# Altium schematic sheet RF_Transceiver_LM6002D.SchDoc
size A4; DocumentNumber: 24; SheetNumber: 24; SheetTotal: 47
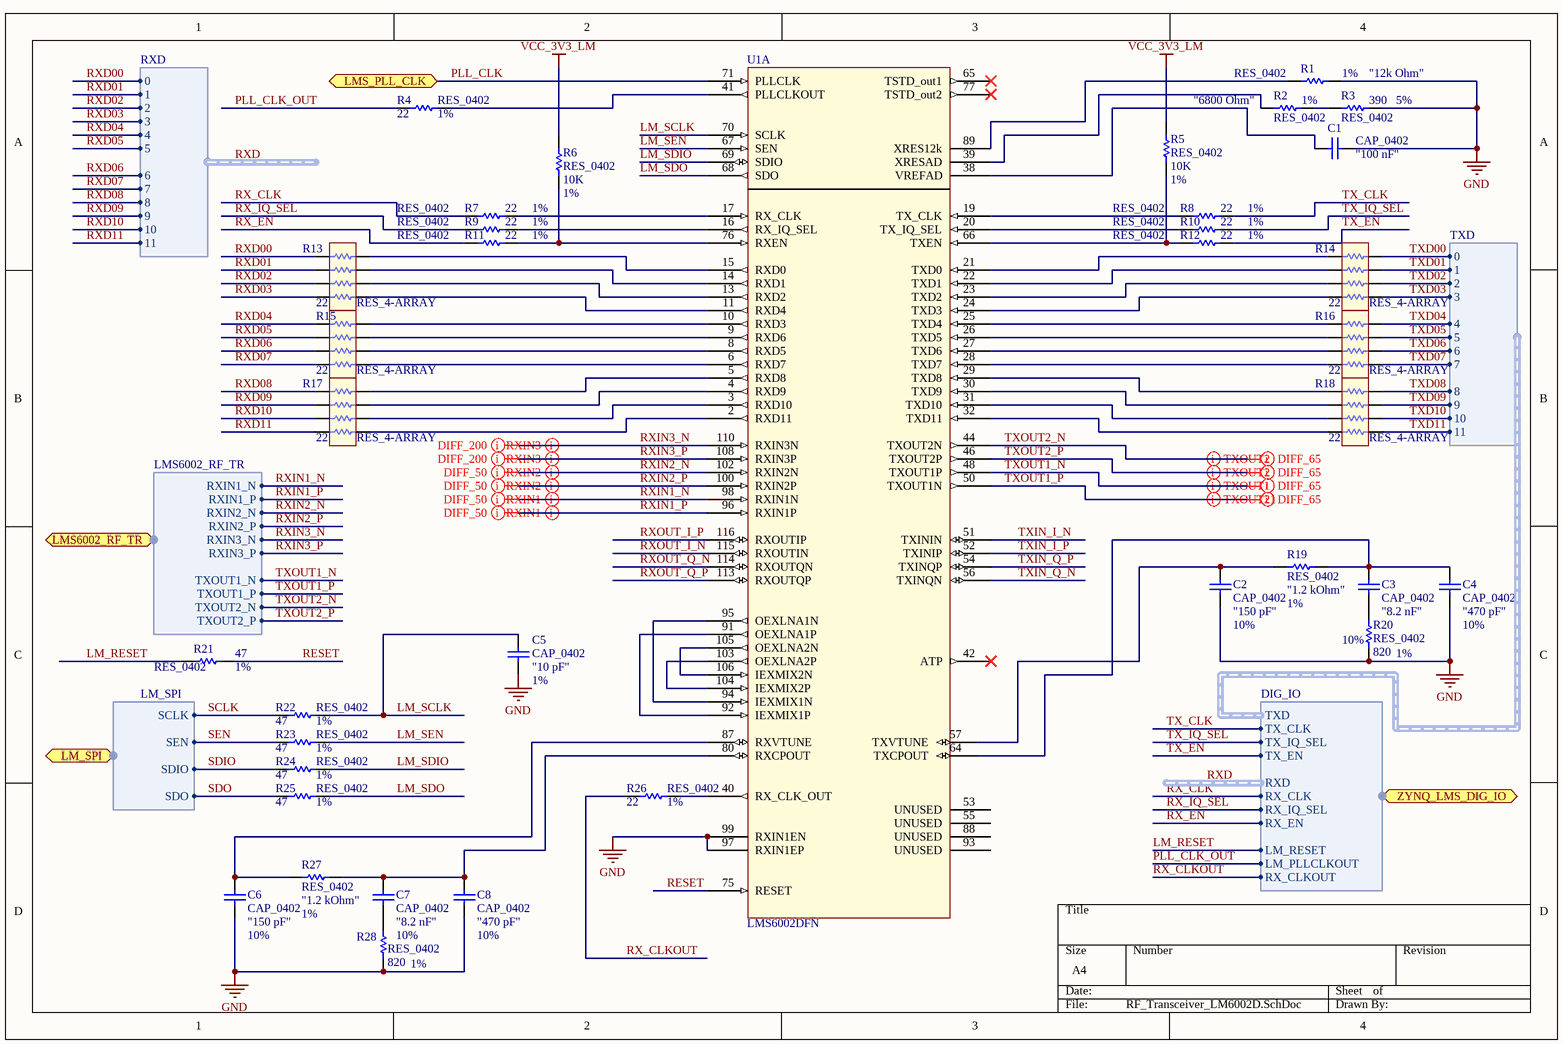
[diagram p0: RF_Transceiver_LM6002D.SchDoc]

## Parts
C1  CAP_0402  value "100 nF"  [CAPC0402(1005)60_N]
C2  CAP_0402  value "150 pF"  Tolerance: 10%  [CAPC0402(1005)60_N]
C3  CAP_0402  value "8.2 nF"  Tolerance: 10%  [CAPC0402(1005)60_N]
C4  CAP_0402  value "470 pF"  Tolerance: 10%  [CAPC0402(1005)60_N]
C5  CAP_0402  value "10 pF"  Tolerance: 1%  [CAPC0402(1005)60_N]
C6  CAP_0402  value "150 pF"  Tolerance: 10%  [CAPC0402(1005)60_N]
C7  CAP_0402  value "8.2 nF"  Tolerance: 10%  [CAPC0402(1005)60_N]
C8  CAP_0402  value "470 pF"  Tolerance: 10%  [CAPC0402(1005)60_N]
R1  RES_0402  value "12k Ohm"  Tolerance: 1%  [RESC0402(1005)_N]
R2  RES_0402  value "6800 Ohm"  Tolerance: 1%  [RESC0402(1005)_N]
R3  RES_0402  value 390  Tolerance: 5%  [RESC0402(1005)_N]
R4  RES_0402  value 22  Tolerance: 1%  [RESC0402(1005)_N]
R5  RES_0402  value 10K  Tolerance: 1%  [RESC0402(1005)_N]
R6  RES_0402  value 10K  Tolerance: 1%  [RESC0402(1005)_N]
R7  RES_0402  value 22  Tolerance: 1%  [RESC0402(1005)_N]
R8  RES_0402  value 22  Tolerance: 1%  [RESC0402(1005)_N]
R9  RES_0402  value 22  Tolerance: 1%  [RESC0402(1005)_N]
R10  RES_0402  value 22  Tolerance: 1%  [RESC0402(1005)_N]
R11  RES_0402  value 22  Tolerance: 1%  [RESC0402(1005)_N]
R12  RES_0402  value 22  Tolerance: 1%  [RESC0402(1005)_N]
R13  RES_4-ARRAY  value 22  [RES_4-ARRAY_YC124-JR-0722RL]
R14  RES_4-ARRAY  value 22  [RES_4-ARRAY_YC124-JR-0722RL]
R15  RES_4-ARRAY  value 22  [RES_4-ARRAY_YC124-JR-0722RL]
R16  RES_4-ARRAY  value 22  [RES_4-ARRAY_YC124-JR-0722RL]
R17  RES_4-ARRAY  value 22  [RES_4-ARRAY_YC124-JR-0722RL]
R18  RES_4-ARRAY  value 22  [RES_4-ARRAY_YC124-JR-0722RL]
R19  RES_0402  value "1.2 kOhm"  Tolerance: 1%  [RESC0402(1005)_N]
R20  RES_0402  value 820  Tolerance: 1%  [RESC0402(1005)_N]
R21  RES_0402  value 47  Tolerance: 1%  [RESC0402(1005)_N]
R22  RES_0402  value 47  Tolerance: 1%  [RESC0402(1005)_N]
R23  RES_0402  value 47  Tolerance: 1%  [RESC0402(1005)_N]
R24  RES_0402  value 47  Tolerance: 1%  [RESC0402(1005)_N]
R25  RES_0402  value 47  Tolerance: 1%  [RESC0402(1005)_N]
R26  RES_0402  value 22  Tolerance: 1%  [RESC0402(1005)_N]
R27  RES_0402  value "1.2 kOhm"  Tolerance: 1%  [RESC0402(1005)_N]
R28  RES_0402  value 820  Tolerance: 1%  [RESC0402(1005)_N]
U1  LMS6002DFN  [RF_Transceiver_LimeMicro_LMS6002D_DQFN-116]  (part A of 2)

## Ports
LM_SPI (harness LM_SPI), LMS6002_RF_TR (harness LMS6002_RF_TR), LMS_PLL_CLK (bidir), ZYNQ_LMS_DIG_IO (harness DIG_IO)

## Harnesses
LMS6002_RF_TR: RXIN1_N, RXIN1_P, RXIN2_N, RXIN2_P, RXIN3_N, RXIN3_P, TXOUT1_N, TXOUT1_P, TXOUT2_N, TXOUT2_P
LM_SPI: SCLK, SEN, SDIO, SDO
TXD: 0, 1, 2, 3, 4, 5, 6, 7, 8, 9, 10, 11
DIG_IO: TXD, TX_CLK, TX_IQ_SEL, TX_EN, RXD, RX_CLK, RX_IQ_SEL, RX_EN, LM_RESET, LM_PLLCLKOUT, RX_CLKOUT
RXD: 0, 1, 2, 3, 4, 5, 6, 7, 8, 9, 10, 11

## Nets
GND: C1.2 C2.1 C4.1 C5.1 C6.1 C8.1 R1.2 R3.2 R20.1 R28.1 U1.97(RXIN1EP) U1.99(RXIN1EN)
VCC_3V3_LM: R5.2 R6.2
LM_RESET: R21.1 ; port ZYNQ_LMS_DIG_IO.LM_RESET
LM_SCLK: C5.2 R22.2 U1.70(SCLK)
LM_SDIO: R24.2 U1.69(SDIO)
LM_SDO: R25.2 U1.68(SDO)
LM_SEN: R23.2 U1.67(SEN)
PLL_CLK: U1.71(PLLCLK) ; port LMS_PLL_CLK
PLL_CLK_OUT: R4.1 ; port ZYNQ_LMS_DIG_IO.LM_PLLCLKOUT
RESET: R21.2 U1.75(RESET)
RX_CLK: R7.1 ; port ZYNQ_LMS_DIG_IO.RX_CLK
RX_CLKOUT: R26.1 ; port ZYNQ_LMS_DIG_IO.RX_CLKOUT
RX_EN: R11.1 ; port ZYNQ_LMS_DIG_IO.RX_EN
RX_IQ_SEL: R9.1 ; port ZYNQ_LMS_DIG_IO.RX_IQ_SEL
RXD00: R13.8 ; harness RXD.0  [project net RXD.0]
RXD01: R13.7 ; harness RXD.1  [project net RXD.1]
RXD02: R13.6 ; harness RXD.2  [project net RXD.2]
RXD03: R13.5 ; harness RXD.3  [project net RXD.3]
RXD04: R15.8 ; harness RXD.4  [project net RXD.4]
RXD05: R15.7 ; harness RXD.5  [project net RXD.5]
RXD06: R15.6 ; harness RXD.6  [project net RXD.6]
RXD07: R15.5 ; harness RXD.7  [project net RXD.7]
RXD08: R17.8 ; harness RXD.8  [project net RXD.8]
RXD09: R17.7 ; harness RXD.9  [project net RXD.9]
RXD10: R17.6 ; harness RXD.10  [project net RXD.10]
RXD11: R17.5 ; harness RXD.11  [project net RXD.11]
RXIN1_N: U1.98(RXIN1N) ; port LMS6002_RF_TR.RXIN1_N
RXIN1_P: U1.96(RXIN1P) ; port LMS6002_RF_TR.RXIN1_P
RXIN2_N: U1.102(RXIN2N) ; port LMS6002_RF_TR.RXIN2_N
RXIN2_P: U1.100(RXIN2P) ; port LMS6002_RF_TR.RXIN2_P
RXIN3_N: U1.110(RXIN3N) ; port LMS6002_RF_TR.RXIN3_N
RXIN3_P: U1.108(RXIN3P) ; port LMS6002_RF_TR.RXIN3_P
RXOUT_I_N: U1.115(RXOUTIN)
RXOUT_I_P: U1.116(RXOUTIP)
RXOUT_Q_N: U1.114(RXOUTQN)
RXOUT_Q_P: U1.113(RXOUTQP)
SCLK: R22.1 ; port LM_SPI.SCLK
SDIO: R24.1 ; port LM_SPI.SDIO
SDO: R25.1 ; port LM_SPI.SDO
SEN: R23.1 ; port LM_SPI.SEN
TX_CLK: R8.2 ; port ZYNQ_LMS_DIG_IO.TX_CLK
TX_EN: R12.2 ; port ZYNQ_LMS_DIG_IO.TX_EN
TX_IQ_SEL: R10.2 ; port ZYNQ_LMS_DIG_IO.TX_IQ_SEL
TXD00: R14.1 ; harness TXD.0
TXD01: R14.2 ; harness TXD.1
TXD02: R14.3 ; harness TXD.2
TXD03: R14.4 ; harness TXD.3
TXD04: R16.1 ; harness TXD.4
TXD05: R16.2 ; harness TXD.5
TXD06: R16.3 ; harness TXD.6
TXD07: R16.4 ; harness TXD.7
TXD08: R18.1 ; harness TXD.8
TXD09: R18.2 ; harness TXD.9
TXD10: R18.3 ; harness TXD.10
TXD11: R18.4 ; harness TXD.11
TXIN_I_N: U1.51(TXININ)
TXIN_I_P: U1.52(TXINIP)
TXIN_Q_N: U1.56(TXINQN)
TXIN_Q_P: U1.54(TXINQP)
TXOUT1_N: U1.48(TXOUT1P) ; port LMS6002_RF_TR.TXOUT1_N
TXOUT1_P: U1.50(TXOUT1N) ; port LMS6002_RF_TR.TXOUT1_P
TXOUT2_N: U1.44(TXOUT2N) ; port LMS6002_RF_TR.TXOUT2_N
TXOUT2_P: U1.46(TXOUT2P) ; port LMS6002_RF_TR.TXOUT2_P
NetC1_1: C1.1 U1.38(VREFAD)
NetC2_2: C2.2 R19.1 U1.57(TXVTUNE)
NetC3_1: C3.1 R20.2
NetC3_2: C3.2 C4.2 R19.2 U1.64(TXCPOUT)
NetC6_2: C6.2 R27.1 U1.87(RXVTUNE)
NetC7_1: C7.1 R28.2
NetC7_2: C7.2 C8.2 R27.2 U1.80(RXCPOUT)
NetR1_1: R1.1 U1.89(XRES12k)
NetR2_1: R2.1 U1.39(XRESAD)
NetR2_2: R2.2 R3.1
NetR4_2: R4.2 U1.41(PLLCLKOUT)
NetR5_1: R5.1 R12.1 U1.66(TXEN)
NetR6_1: R6.1 R11.2 U1.76(RXEN)
NetR7_2: R7.2 U1.17(RX_CLK)
NetR8_1: R8.1 U1.19(TX_CLK)
NetR9_2: R9.2 U1.16(RX_IQ_SEL)
NetR10_1: R10.1 U1.20(TX_IQ_SEL)
NetR13_1: R13.1 U1.15(RXD0)
NetR13_2: R13.2 U1.14(RXD1)
NetR13_3: R13.3 U1.13(RXD2)
NetR13_4: R13.4 U1.11(RXD4)
NetR14_5: R14.5 U1.24(TXD3)
NetR14_6: R14.6 U1.23(TXD2)
NetR14_7: R14.7 U1.22(TXD1)
NetR14_8: R14.8 U1.21(TXD0)
NetR15_1: R15.1 U1.10(RXD3)
NetR15_2: R15.2 U1.9(RXD6)
NetR15_3: R15.3 U1.8(RXD5)
NetR15_4: R15.4 U1.6(RXD7)
NetR16_5: R16.5 U1.28(TXD7)
NetR16_6: R16.6 U1.27(TXD6)
NetR16_7: R16.7 U1.26(TXD5)
NetR16_8: R16.8 U1.25(TXD4)
NetR17_1: R17.1 U1.5(RXD8)
NetR17_2: R17.2 U1.4(RXD9)
NetR17_3: R17.3 U1.3(RXD10)
NetR17_4: R17.4 U1.2(RXD11)
NetR18_5: R18.5 U1.32(TXD11)
NetR18_6: R18.6 U1.31(TXD10)
NetR18_7: R18.7 U1.30(TXD9)
NetR18_8: R18.8 U1.29(TXD8)
NetR26_2: R26.2 U1.40(RX_CLK_OUT)
NetU1_91: U1.91(OEXLNA1P) U1.92(IEXMIX1P)
NetU1_94: U1.94(IEXMIX1N) U1.95(OEXLNA1N)
NetU1_103: U1.103(OEXLNA2P) U1.104(IEXMIX2P)
NetU1_105: U1.105(OEXLNA2N) U1.106(IEXMIX2N)

Not connected (* = marked no-connect by the designer): U1 42(ATP)* 53(UNUSED) 55(UNUSED) 65(TSTD_out1)* 77(TSTD_out2)* 88(UNUSED) 93(UNUSED)

## Layout directives
differential pair: RXIN1_N, RXIN1_P, RXIN2_N, RXIN2_P, RXIN3_N, RXIN3_P, TXOUT1_N, TXOUT1_P, TXOUT2_N, TXOUT2_P
mark named DIFF_65: TXOUT1_N, TXOUT1_P, TXOUT2_N, TXOUT2_P
mark named DIFF_200: RXIN3_N, RXIN3_P
mark named DIFF_50: RXIN1_N, RXIN1_P, RXIN2_N, RXIN2_P

## Library data of the parts
C1 = "C0402C104K8PAC": C 100 nF 16 V 0402 X5R; Manufacturer: KEMET; Tolerance: *; Part Number: "C0402C104K8PAC"; Footprint Ref: CAPC0402(1005)60_N; Library Ref: CAP_0402
C2 C6 = "MCCA000122": C 470pF 50V X7R 10% 0402; Manufacturer: MULTICOMP; Part Number: "MCCA000122"; Footprint Ref: CAPC0402(1005)60_N; Library Ref: CAP_0402
C3 C7 = "MCCA000039": C 470pF 50V X7R 10% 0402; Manufacturer: MULTICOMP; Part Number: "MCCA000039"; Footprint Ref: CAPC0402(1005)60_N; Library Ref: CAP_0402
C4 C8 = "MCCA000132": C 470pF 50V X7R 10% 0402; Manufacturer: MULTICOMP; Part Number: "MCCA000132"; Footprint Ref: CAPC0402(1005)60_N; Library Ref: CAP_0402
C5 = "MC0402N100F500CT": C 10pF 1% 50V NP0 0402; Manufacturer: MULTICOMP; Part Number: "MC0402N100F500CT"; Footprint Ref: CAPC0402(1005)60_N; Library Ref: CAP_0402
R1 = "MC 0.0625W 0402 1% 12K": R 12 kOhm 1 % 63 mW 0402; Manufacturer: MULTICOMP; Part Number: "MC 0.0625W 0402 1% 12K"; Footprint Ref: RESC0402(1005)_N; Library Ref: RES_0402
R2 = "232270676802": R 6800 Ohm 1 % 63 mW 0402; Manufacturer: PHYCOMP; Part Number: "232270676802"; Footprint Ref: RESC0402(1005)_N; Library Ref: RES_0402
R3 = RC0402JR-07390RL: 390 ohm, 5%, 1/16W, 0402; Manufacturer: Yageo America; Part Number: RC0402JR-07390RL; Footprint Ref: RESC0402(1005)_N; Library Ref: RES_0402
R4 R7-R12 R26 = ERJ-2RKF22R0X: RES 22.0 OHM 1/10W 1% 0402 SMD; Manufacturer: Panasonic Electronic Components; Part Number: ERJ-2RKF22R0X
R5 R6 = ERJ-2RKF1002X: RES 10.0K OHM 1/10W 1% 0402 SMD; Manufacturer: Panasonic Electronic Components; Part Number: ERJ-2RKF1002X
R13-R18 = YC124-JR-0722RL: RES ARRAY 22 OHM 4 RES 0804; Manufacturer: Yageo; Tolerance: *; Part Number: YC124-JR-0722RL
R19 R27 = "CRCW04021K20FKEAHP": R 1k2 Ohm 1% 63mV 0402; Manufacturer: VISHAY DRALORIC; Part Number: "CRCW04021K20FKEAHP"; Footprint Ref: RESC0402(1005)_N; Library Ref: RES_0402
R20 R28 = ERJ-2RKF8200X: RES 820 OHM 1/10W 1% 0402 SMD; Manufacturer: Panasonic Electronic Components; Part Number: ERJ-2RKF8200X; Footprint Ref: RESC0402(1005)_N; Library Ref: RES_0402
R21-R25 = ERJ-2RKF47R0X: RES 47.0 OHM 1/10W 1% 0402 SMD; Manufacturer: Panasonic Electronic Components; Part Number: ERJ-2RKF47R0X
U1 = LMS6002DFN: RF Transceiver LMS6002D, 120 pin DQFN package, 1.8V and 3.3V; Manufacturer: Lime Micro; Part Number: LMS6002DFN